# Altium project drin.PrjPCB
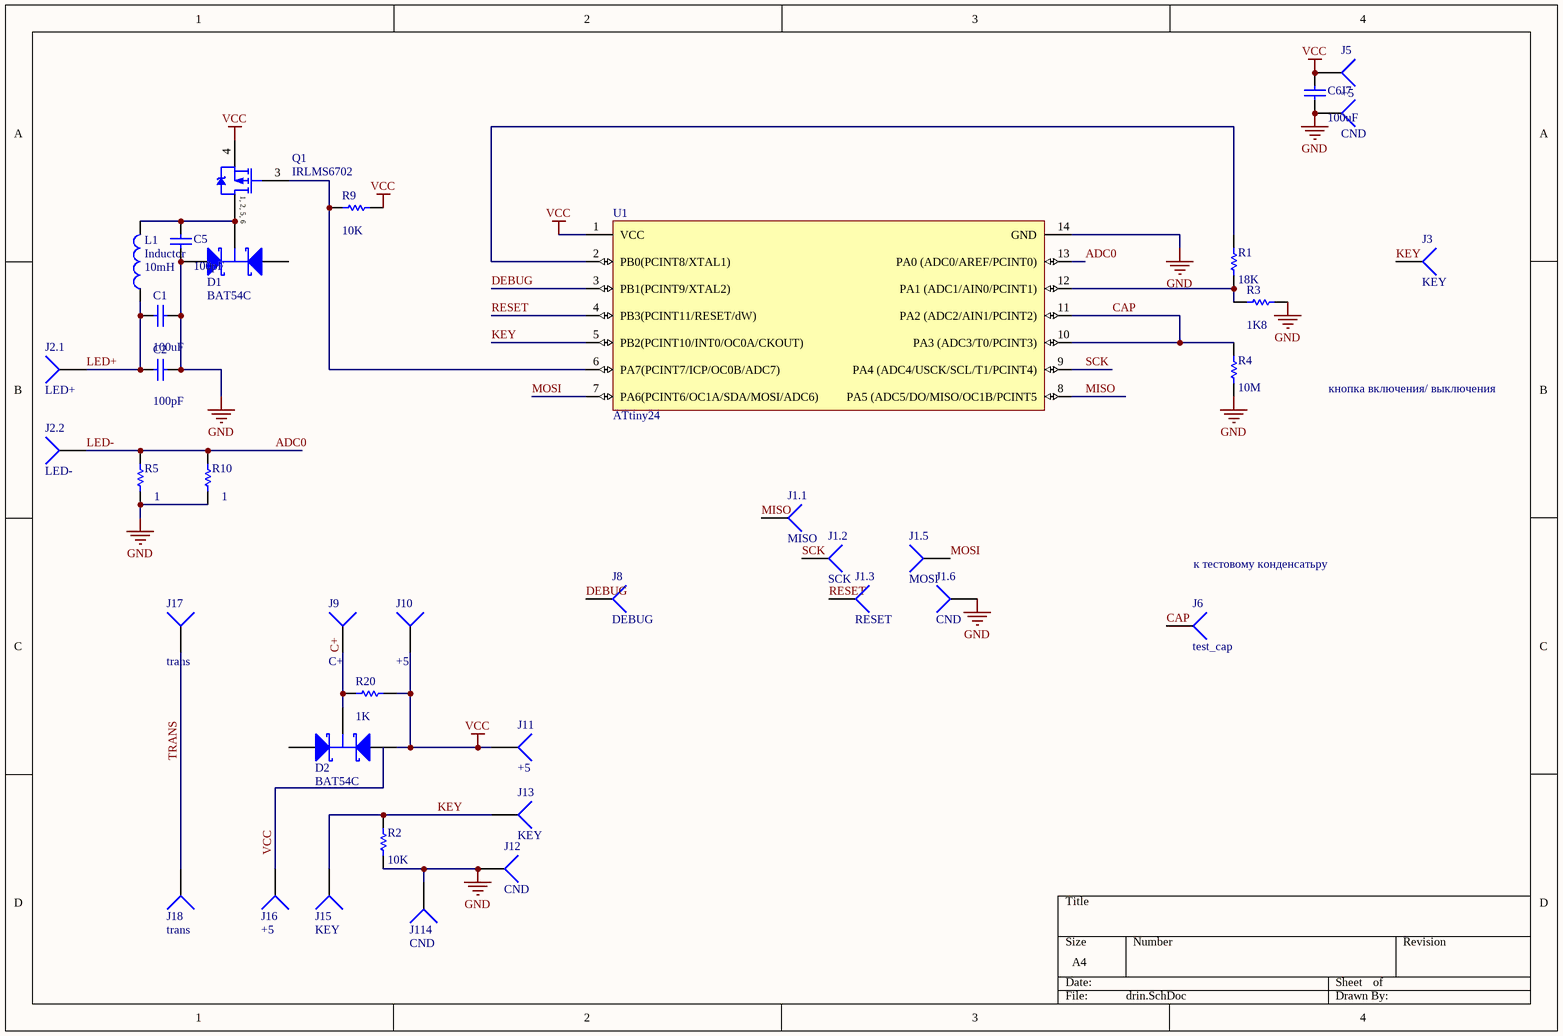
[diagram p0: drin.SchDoc]
1 sheet, 39 parts. Net scope: global (net labels, ports and power ports of the same name join across sheets).
Board file: drin.PcbDoc

## Sheet drin.SchDoc
size A4

### Parts
C1  100uF  [C1210]
C2  100pF  [2012[0805]A]
C5  100pF  [1608[0603]A]
C6  100uF  [C1210]
D1  BAT54C  [SOT23_N]
D2  BAT54C  [SOT23_N]
J1.1  MISO  [PIN1]
J1.2  SCK  [PIN1]
J1.3  RESET  [PIN1]
J1.5  MOSI  [PIN1]
J1.6  CND  [PIN1]
J2.1  LED+  [PIN1]
J2.2  LED-  [PIN1]
J3  KEY  [PIN1]
J5  +5  [PIN1]
J6  test_cap  [PIN1]
J7  CND  [PIN1]
J8  DEBUG  [PIN1]
J9  C+  [PIN1]
J10  +5  [PIN1]
J11  +5  [PIN1]
J12  CND  [PIN1]
J13  KEY  [PIN1]
J15  KEY  [PIN1]
J16  +5  [PIN1]
J17  trans  [PIN1]
J18  trans  [PIN1]
J114  CND  [PIN1]
L1  Inductor  value 10mH  [6332[2512]]
Q1  IRLMS6702  [Micro6]
R1  18K  [1608[0603]A]
R2  10K  [1608[0603]A]
R3  1K8  [1608[0603]A]
R4  10M  [1608[0603]A]
R5  1  [1608[0603]A]
R9  10K  [1608[0603]A]
R10  1  [1608[0603]A]
R20  1K  [1608[0603]A]
U1  ATtiny24  [SOIC14_M]

### Nets
GND: C1.2 C2.2 C5.1 C6.1 D1.1(A1) J1.6.1 J7.1 J12.1 J114.1 R2.1 R3.1 R4.1 R5.1 R10.1 U1.14(GND)
VCC: C6.2 D2.2(A2) J5.1 J10.1 J11.1 J16.1 Q1.4(S) R9.1 R20.2 U1.1(VCC)
ADC0: J2.2.1 R5.2 R10.2 U1.13(PA0_(ADC0/AREF/PCINT0))  [also labelled LED-]
C+: D2.3(K) J9.1 R20.1
CAP: J6.1 R4.2 U1.10(PA3_(ADC3/T0/PCINT3)) U1.11(PA2_(ADC2/AIN1/PCINT2))
DEBUG: J8.1 U1.3(PB1(PCINT9/XTAL2))
KEY: J3.1 J13.1 J15.1 R2.2 U1.5(PB2(PCINT10/INT0/OC0A/CKOUT))
LED+: C1.1 C2.1 J2.1.1 L1.1
MISO: J1.1.1 U1.8(PA5_(ADC5/DO/MISO/OC1B/PCINT5)
MOSI: J1.5.1 U1.7(PA6(PCINT6/OC1A/SDA/MOSI/ADC6))
RESET: J1.3.1 U1.4(PB3(PCINT11/RESET/dW))
SCK: J1.2.1 U1.9(PA4_(ADC4/USCK/SCL/T1/PCINT4))
TRANS: J17.1 J18.1
NetC5_2: C5.2 D1.3(K) L1.2 Q1.1(D) Q1.2(D) Q1.5(D) Q1.6(D)
NetQ1_3: Q1.3(G) R9.2 U1.6(PA7(PCINT7/ICP/OC0B/ADC7))
NetR1_1: R1.1 R3.2 U1.12(PA1_(ADC1/AIN0/PCINT1))
NetR1_2: R1.2 U1.2(PB0(PCINT8/XTAL1))

Not connected (* = marked no-connect by the designer): D1 2(A2); D2 1(A1)

### Notes on the sheet
- кнопка включения/ выключения
- к тестовому конденсатьру
- (in symbol IRLMS6702) 1, 2, 5, 6

### Library data of the parts
C1 C2 C5 C6 = Cap Semi: Capacitor (Semiconductor SIM Model); Published: 8-Jun-2000; LatestRevisionDate: 17-Jul-2002; LatestRevisionNote: Re-released for DXP Platform.; PackageReference: C1206; Publisher: Altium Limited
  C1 C6: Value: 100uF
  C2 C5: Value: 100pF
D1 D2 = BAT54C: Schottky Barrier Double Diode; Published: 17-Sep-2003; LatestRevisionDate: 12-Dec-2006; LatestRevisionNote: IPC-7351 Footprint Added.; DatasheetVersion: 4-Mar-2002; PackageVersion: May-1999; PackageReference: SOT23; Publisher: Altium Limited; PackageDescription: 3-Pin SOT-23 Package 0.95 mm Pitch, 2.3 mm Lead Span; ComponentLink1Description: Manufacturer Link; ComponentLink1URL: http://www.semiconductors.philips.com/; ComponentLink2Description: Datasheet; ComponentLink2URL: http://www.semiconductors.philips.com/acrobat/datasheets/BAT54_SERIES_4.pdf
J1.1-J1.3 J1.5 J1.6 J2.1 J2.2 J3 J5-J13 J15-J18 J114 = Socket: LatestRevisionDate: 17-Jul-2002; LatestRevisionNote: Re-released for DXP Platform.; Publisher: Altium Limited
L1 = Inductor: Code_IEC: 1005; Published: 8-Jun-2000; LatestRevisionDate: 17-Jul-2002; LatestRevisionNote: Re-released for DXP Platform.; PackageReference: 0402-A; Publisher: Altium Limited; Code_JEITA: 0402
Q1 = IRLMS6702: HEXFET Power MOSFET; Published: 8-Jun-2000; LatestRevisionDate: 17-Jul-2002; LatestRevisionNote: Re-released for DXP Platform.; DatasheetVersion: Aug-1997; PackageReference: Micro6; Publisher: Altium Limited; PackageDescription: SOT-457/SC-74; 6 Leads; Body 3 x 3 mm, inc. leads (LxW max); ComponentLink1Description: Manufacturer Link; ComponentLink1URL: http://www.irf.com/; ComponentLink2Description: Datasheet; ComponentLink2URL: http://www.irf.com/product-info/datasheets/data/irlms6702.pdf
R1-R5 R9 R10 R20 = Res Semi: Semiconductor Resistor; Published: 8-Jun-2000; LatestRevisionDate: 17-Jul-2002; LatestRevisionNote: Re-released for DXP Platform.; PackageReference: AXIAL-0.5; Publisher: Altium Limited
  R1: Value: 18K
  R2 R9: Value: 10K
  R3: Value: 1K8
  R4: Value: 10M
  R5 R10: Value: 1
  R20: Value: 1K
U1 = ATtiny24: 8-Bit AVR Microcontroller with 1K Byte of Flash Memory; Published: 17-Sep-2003; LatestRevisionDate: 13-Apr-2006; LatestRevisionNote: IPC-7351 Footprint Added.; DatasheetVersion: 1187E-AVR-06/02; PackageVersion: revB, May-2002; PackageReference: 8S2; Publisher: Altium Limited; PackageDescription: 8-Pin Small Outline Package 1.27 mm Pitch; ComponentLink1Description: Manufacturer Link; ComponentLink1URL: http://www.atmel.com; ComponentLink2Description: Datasheet; ComponentLink2URL: http://www.atmel.com/dyn/resources/prod_documents/doc1187.pdf